# Altium project PrintNC_GRBLHAL_Breakout.PrjPCB (part 2 of 2)

## Sheet 5V_Power_Supply.SchDoc: GRBLHAL_2000_EST
size B; Author: AM; CompanyName: Expatria Technologies; DrawnBy: A.Marles; Engineer: AM; Organization: Expatria Technologies; DocumentNumber: 4; Revision: A1; SheetNumber: 4; SheetTotal: 14; PCB_Rev: A1
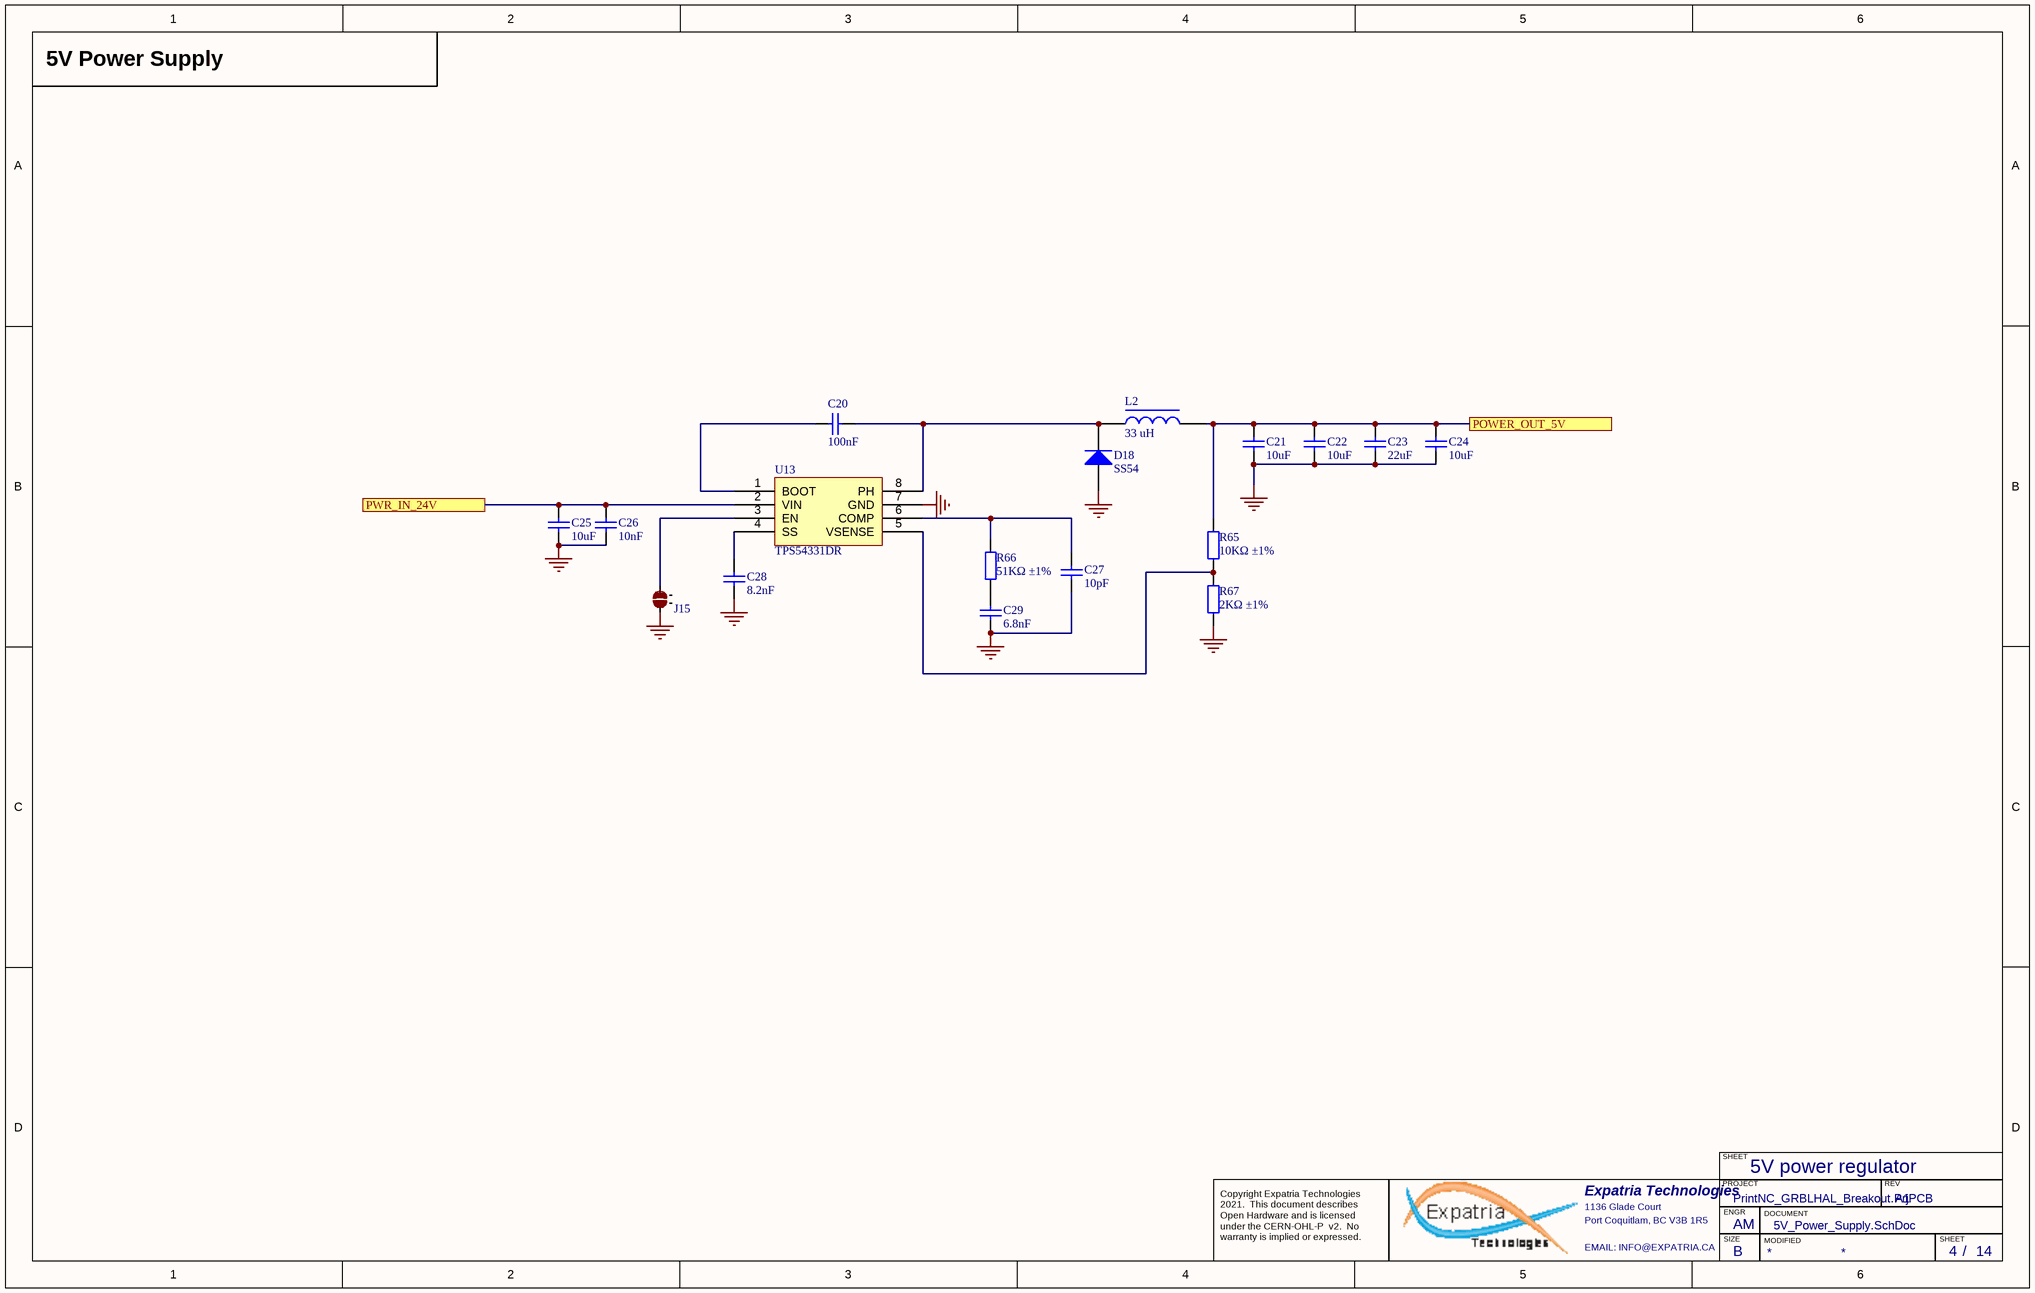
[diagram p12: 5V_Power_Supply.SchDoc]

### Parts
C20  100nF  [0603_C]
C21  10uF  [0603_C]
C22  10uF  [0603_C]
C23  22uF  [0805_C]
C24  10uF  [0603_C]
C25  10uF  [1206_C]
C26  10nF  [0402_C]
C27  10pF  [0402_C]
C28  8.2nF  [0603_C]
C29  6.8nF  [0402_C]
D18  SS54  [SMA(DO-214AC)_S1]
J15  2 way net solder junction - Normally Open  [2waySolder_NO]  (value not drawn)  (no BOM)
L2  33 uH  [INDPM7366X300N]
R65  10KΩ ±1%  [0402_R]
R66  51KΩ ±1%  [0402_R]
R67  2KΩ ±1%  [0402_R]
U13  TPS54331DR  [SOIC-8_150mil]

### Ports
POWER_OUT_5V, PWR_IN_24V

### Nets
+5V: C21.2 C22.2 C23.2 C24.2 L2.2 R65.2 ; port POWER_OUT_5V
+24V: C25.2 C26.2 U13.2(VIN) ; port PWR_IN_24V
GND: C21.1 C22.1 C23.1 C24.1 C25.1 C26.1 C27.1 C28.1 C29.1 D18.1(A) J15.1 R67.1 U13.7(GND)
NetC20_1: C20.1 U13.1(BOOT)
NetC20_2: C20.2 D18.2(K) L2.1 U13.8(PH)
NetC27_2: C27.2 R66.2 U13.6(COMP)
NetC28_2: C28.2 U13.4(SS)
NetC29_2: C29.2 R66.1
NetJ15_2: J15.2 U13.3(EN)
NetR65_1: R65.1 R67.2 U13.5(VSENSE)

### Notes on the sheet
- 5V Power Supply
- 5V power regulator
- SHEET
- Expatria Technologies
- 1136 Glade Court
- Port Coquitlam, BC V3B 1R5
- PROJECT
- SIZE
- ENGR
- MODIFIED
- DOCUMENT
- REV
- Copyright Expatria Technologies 2021.  This document describes Open Hardware and is licensed under the CERN-OHL-P  v2.  No warranty is implied or expressed.
- EMAIL: INFO@EXPATRIA.CA
- B
- /

### Library data of the parts
C20 = 0603 100nF (104) 10% 50V: Chip capacitors; Manufacturer: YAGEO; PartNumber: CC0603KRX7R9BB104; Tolerance: 10%; Voltage: 50V; Package: 0603; Supplier: LC; SuppliersPartNumber: C14663; Capacitance: 100nF
C21 C22 C24 = 0603 10uF (106) 10% 10V: Chip capacitors; Manufacturer: Samsung Electro-Mechanics; PartNumber: CL10A106KP8NNNC; Tolerance: 10%; Voltage: 10V; Package: 0603; Supplier: LC; SuppliersPartNumber: C19702; Capacitance: 10uF
C23 = 0805 22uF (226) 20% 25V: Chip capacitors; Manufacturer: Samsung Electro-Mechanics; PartNumber: CL21A226MAQNNNE; Tolerance: 20%; Voltage: 25V; Package: 0805; Supplier: LC; SuppliersPartNumber: C45783; Capacitance: 22uF
C25 = 1206 10uF (106) 10% 50V: Chip capacitors; Manufacturer: Samsung Electro-Mechanics; PartNumber: CL31A106KBHNNNE; Tolerance: 10%; Voltage: 50V; Package: 1206; Supplier: LC; SuppliersPartNumber: C13585; Capacitance: 10uF
C26 = 0402 10nF (103) 10% 50V: Chip capacitors; Manufacturer: Samsung Electro-Mechanics; PartNumber: CL05B103KB5NNNC; Tolerance: 10%; Voltage: 50V; Package: 0402; Supplier: LC; SuppliersPartNumber: C15195; Capacitance: 10nF
C27 = 0402 10pF (100) 5% 50V: Chip capacitors; Manufacturer: Samsung Electro-Mechanics; PartNumber: CL05C100JB5NNNC; Tolerance: 5%; Voltage: 50V; Package: 0402; Supplier: LC; SuppliersPartNumber: C32949; Capacitance: 10pF
C28 = 0603 8.2nF (822) 10% 50V: Chip capacitors; Manufacturer: Samsung Electro-Mechanics; PartNumber: CL10B822KB8NNNC; Tolerance: 10%; Voltage: 50V; Package: 0603; Supplier: LC; SuppliersPartNumber: C27920; Capacitance: 8.2nF
C29 = 0402 6.8nF (682) 10% 50V: Chip capacitors; Manufacturer: Guangdong Fenghua Advanced Tech; PartNumber: 0402B682K500NT; Tolerance: 10%; Voltage: 50V; Package: 0402; Supplier: LC; SuppliersPartNumber: C1542; Capacitance: 6.8nF
D18 = SMA(DO-214AC) SS54: 二极管; Package: SMA(DO-214AC); Supplier: LC; SuppliersPartNumber: C22452
J15 = 2waySolderNO
L2 = 1206 10uH 10%: 33uH ±20% 2A 270mΩ SMD,6.6x7.3x3.0mm Power Inductors RoHS; Package: SMD_6.6x7.3x3.0mm; Supplier: JLCPCB; SuppliersPartNumber: C329385
R65 = 0402 10K (1002) 1%: Chip resistor; Manufacturer: Uniroyal Elec; PartNumber: 0402WGF1002TCE; Power: 1/16W; Package: 0402; Supplier: LC; SuppliersPartNumber: C25744; Resistance: 10KΩ; Tolerance: 1%
R66 = 0402 51K (5102) 1%: Chip resistor; Manufacturer: Uniroyal Elec; PartNumber: 0402WGF5102TCE; Power: 1/16W; Package: 0402; Supplier: LC; SuppliersPartNumber: C25794; Resistance: 51KΩ; Tolerance: 1%
R67 = 0402 2K (2001) 1%: Chip resistor; Manufacturer: Uniroyal Elec; PartNumber: 0402WGF2001TCE; Power: 1/16W; Package: 0402; Supplier: LC; SuppliersPartNumber: C4109; Resistance: 2KΩ; Tolerance: 1%
U13 = TPS54331DR_[C9865]: DC-DC芯片; Package: SOIC-8_150mil; Supplier: LC; SuppliersPartNumber: C9865

## Sheet I2C_Keypad.SchDoc: GRBLHAL_2000_EST
size B; Author: AM; CompanyName: Expatria Technologies; DrawnBy: A.Marles; Engineer: AM; Organization: Expatria Technologies; DocumentNumber: 13; Revision: A1; SheetNumber: 13; SheetTotal: 14; PCB_Rev: A1
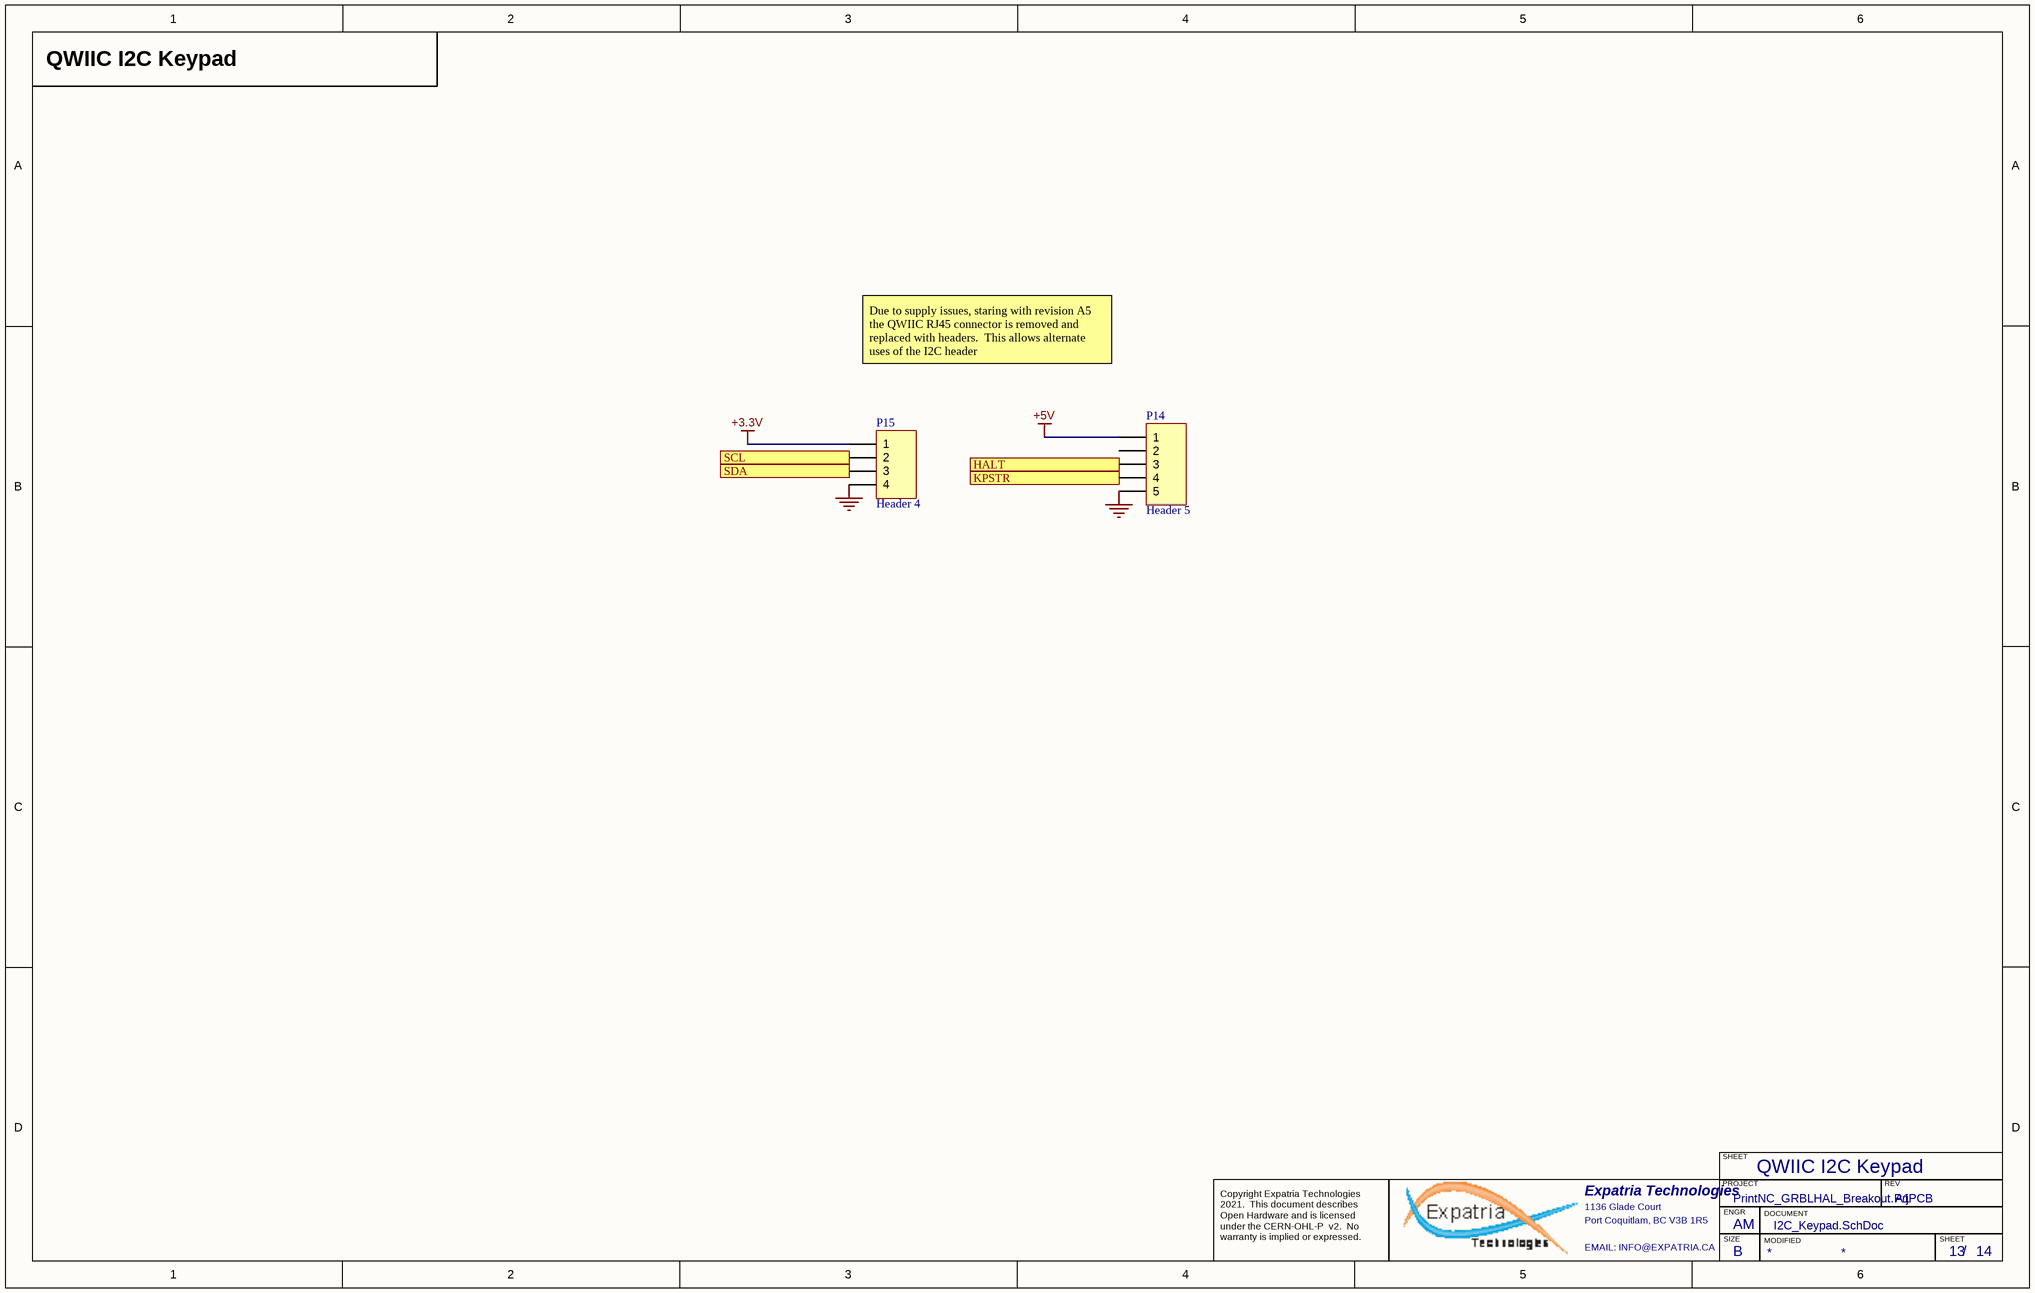
[diagram p13: I2C_Keypad.SchDoc]

### Parts
P14  Header 5  [HDR1X5]
P15  Header 4  [HDR1X4]

### Ports
HALT (out), KPSTR (out), SCL (in), SDA (in)

### Nets
+3.3V: P15.1
+5V: P14.1
GND: P14.5 P15.4
HALT: P14.3 ; port HALT
KPSTR: P14.4 ; port KPSTR
SCL: P15.2 ; port SCL
SDA: P15.3 ; port SDA

Not connected (* = marked no-connect by the designer): P14 2

### Notes on the sheet
- QWIIC I2C Keypad
- Due to supply issues, staring with revision A5 the QWIIC RJ45 connector is removed and replaced with headers.  This allows alternate uses of the I2C header
- SHEET
- Expatria Technologies
- 1136 Glade Court
- Port Coquitlam, BC V3B 1R5
- PROJECT
- SIZE
- ENGR
- MODIFIED
- DOCUMENT
- REV
- Copyright Expatria Technologies 2021.  This document describes Open Hardware and is licensed under the CERN-OHL-P  v2.  No warranty is implied or expressed.
- EMAIL: INFO@EXPATRIA.CA
- B
- /

### Library data of the parts
P14 = Header 5: Header, 5-Pin; LatestRevisionDate: 17-Jul-2002; LatestRevisionNote: Re-released for DXP Platform.; Publisher: Altium Limited; SuppliersPartNumber: C124379
P15 = Header 4: Header, 4-Pin; Publisher: Altium Limited; SuppliersPartNumber: C124378

## Sheet Spindle_Sync.SchDoc: GRBLHAL_2000_EST
size B; Author: AM; CompanyName: Expatria Technologies; DrawnBy: A.Marles; Engineer: AM; Organization: Expatria Technologies; DocumentNumber: 12; Revision: A1; SheetNumber: 12; SheetTotal: 14; PCB_Rev: A1
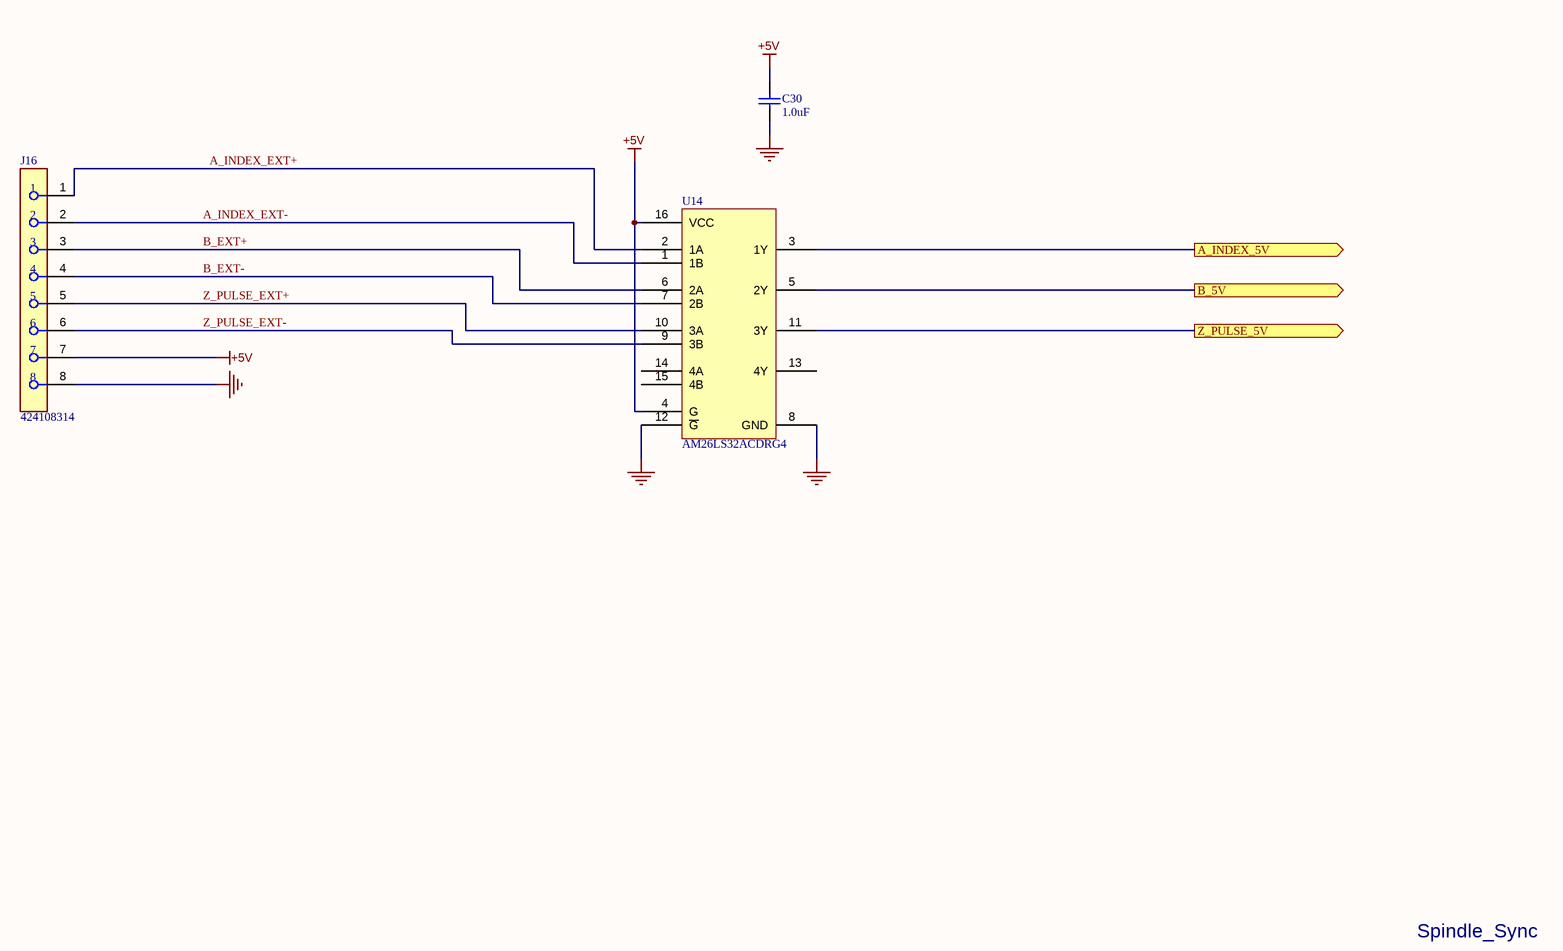
[diagram p14: Spindle_Sync.SchDoc]

### Parts
C30  1.0uF  [0402_C]
J16  424108314  [FP-5555799-1-MFG]
U14  AM26LS32ACDRG4  [SOIC-16_150mil]

### Ports
A_INDEX_5V (out), B_5V (out), Z_PULSE_5V (out)

### Nets
+5V: C30.2 J16.7 U14.4(G) U14.16(VCC)
GND: C30.1 J16.8 U14.8(GND) U14.12(~{G})
A_INDEX_EXT+: J16.1 U14.2(1A)
A_INDEX_EXT-: J16.2 U14.1(1B)
B_EXT+: J16.3 U14.6(2A)
B_EXT-: J16.4 U14.7(2B)
EXT_IN1: U14.5(2Y) ; port B_5V
EXT_IN2: U14.3(1Y) ; port A_INDEX_5V
EXT_IN3: U14.11(3Y) ; port Z_PULSE_5V
Z_PULSE_EXT+: J16.5 U14.10(3A)
Z_PULSE_EXT-: J16.6 U14.9(3B)

Not connected (* = marked no-connect by the designer): U14 13(4Y) 14(4A) 15(4B)

### Notes on the sheet
- Spindle_Sync
- SHEET
- Expatria Technologies
- 1136 Glade Court
- Port Coquitlam, BC V3B 1R5
- PROJECT
- SIZE
- ENGR
- MODIFIED
- DOCUMENT
- REV
- Copyright Expatria Technologies 2021.  This document describes Open Hardware and is licensed under the CERN-OHL-P  v2.  No warranty is implied or expressed.
- EMAIL: INFO@EXPATRIA.CA
- B
- /

### Library data of the parts
C30 = 0402 1.0uF (105) 10% 25V: Chip capacitor; Manufacturer: Samsung Electro-Mechanics; PartNumber: CL05A105KA5NQNC; Capacitance: 1uF; Tolerance: 10%; Voltage: 25V; Package: 0402; Supplier: LC; SuppliersPartNumber: C52923
J16 = CMP-03371-000003-1: CONN MOD JACK 8P8C VERT UNSHLD; SuppliersPartNumber: C563815; Supplier: LCSC
U14 = AM26LS32ACDRG4_[C6180]: 接口芯片; Package: SOIC-16_150mil; Supplier: LC; SuppliersPartNumber: C6180

## Sheet RS485.SchDoc: GRBLHAL_2000_EST
size B; Author: AM; CompanyName: Expatria Technologies; DrawnBy: A.Marles; Engineer: AM; Organization: Expatria Technologies; DocumentNumber: 11; Revision: A1; SheetNumber: 11; SheetTotal: 14; PCB_Rev: A1
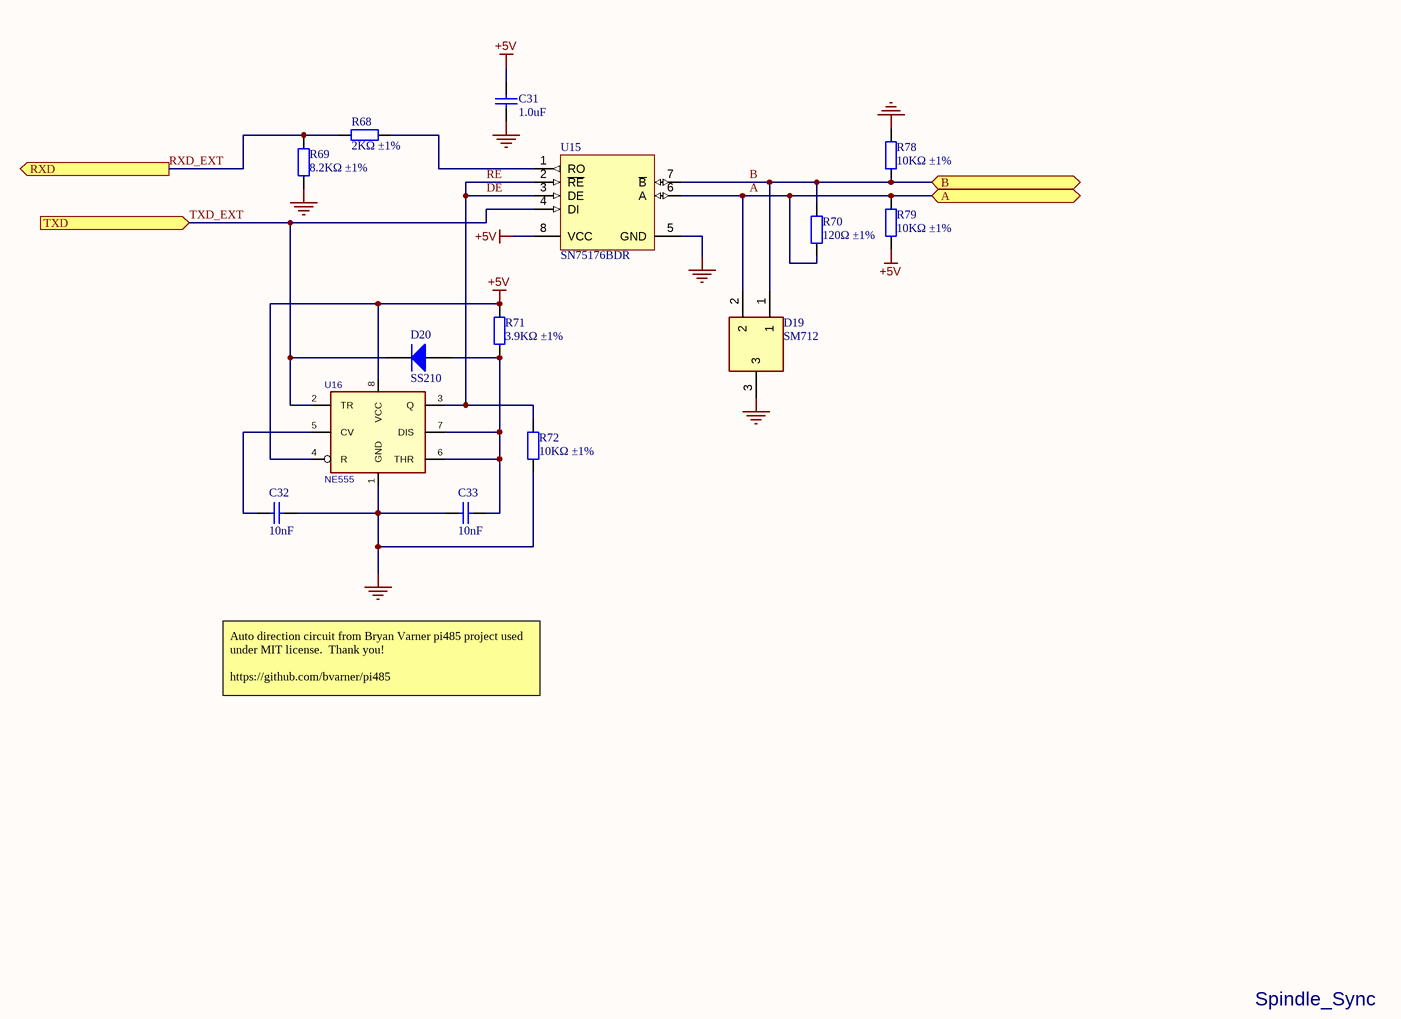
[diagram p15: RS485.SchDoc]

### Parts
C31  1.0uF  [0402_C]
C32  10nF  [0402_C]
C33  10nF  [0402_C]
D19  SM712  [SOT95P230X117-3N]
D20  SS210  [SMA(DO-214AC)_S1]
R68  2KΩ ±1%  [0402_R]
R69  8.2KΩ ±1%  [0402_R]
R70  120Ω ±1%  [0805_R]
R71  3.9KΩ ±1%  [0402_R]
R72  10KΩ ±1%  [0402_R]
R78  10KΩ ±1%  [0402_R]
R79  10KΩ ±1%  [0402_R]
U15  SN75176BDR  [SOIC-8_150mil]
U16  value NE555  [SOIC-8_150mil]  (hidden comment: NE555DR)

### Ports
A (bidir), B (bidir), RXD (out), TXD (in)

### Nets
+5V: C31.2 R71.2 R79.1 U15.8(VCC) U16.4(R) U16.8(VCC)
GND: C31.1 C32.2 C33.1 D19.3 R69.2 R72.1 R78.2 U15.5(GND) U16.1(GND)
A: D19.2 R70.1 R79.2 U15.6(A) ; port A
B: D19.1 R70.2 R78.1 U15.7(~{B}) ; port B
DE: R72.2 U15.2(~{RE}) U15.3(DE) U16.3(Q)  [also labelled RE]
RXD_EXT: R68.2 R69.1 ; port RXD
TXD_EXT: D20.2(K) U15.4(DI) U16.2(TR) ; port TXD
NetC32_1: C32.1 U16.5(CV)
NetC33_2: C33.2 D20.1(A) R71.1 U16.6(THR) U16.7(DIS)
NetR68_1: R68.1 U15.1(RO)

### Notes on the sheet
- Auto direction circuit from Bryan Varner pi485 project used under MIT license.  Thank you!
  https://github.com/bvarner/pi485
- Spindle_Sync
- SHEET
- Expatria Technologies
- 1136 Glade Court
- Port Coquitlam, BC V3B 1R5
- PROJECT
- SIZE
- ENGR
- MODIFIED
- DOCUMENT
- REV
- Copyright Expatria Technologies 2021.  This document describes Open Hardware and is licensed under the CERN-OHL-P  v2.  No warranty is implied or expressed.
- EMAIL: INFO@EXPATRIA.CA
- B
- /

### Library data of the parts
C31 = 0402 1.0uF (105) 10% 25V: as C30 on sheet Spindle_Sync; Package: 0402; Supplier: LC; SuppliersPartNumber: C52923
C32 C33 = 0402 10nF (103) 10% 50V: as C26 on sheet 5V_Power_Supply; Package: 0402; Supplier: LC; SuppliersPartNumber: C15195; Capacitance: 10nF
D19 = CDSOT23-SM712: Bidirectional 12V (Max), 7V (Max) 7.5V / 13.3V 10V / 20V 12A(8/20us) SOT-23-3 TVS RoHS; Manufacturer_Name: DOWO; Height: 1.17mm; Manufacturer_Part_Number: SM712; SuppliersPartNumber: C293966
D20 = SMA(DO-214AC) SS210: 二极管; Package: SMA(DO-214AC); Supplier: LC; SuppliersPartNumber: C14996
R68 = 0402 2K (2001) 1%: as R67 on sheet 5V_Power_Supply; Package: 0402; Supplier: LC; SuppliersPartNumber: C4109; Resistance: 2KΩ; Tolerance: 1%
R69 = 0402 8.2K (8201) 1%: Chip resistor; Manufacturer: Uniroyal Elec; PartNumber: 0402WGF8201TCE; Power: 1/16W; Package: 0402; Supplier: LC; SuppliersPartNumber: C25924; Resistance: 8.2KΩ; Tolerance: 1%
R70 = 0805 120R (1200) 1%: Chip resistor; Manufacturer: Uniroyal Elec; Power: 1/8W; Package: 0805; Supplier: LC; SuppliersPartNumber: C17437; Tolerance: 1%
R71 = 0402 3.9K (3901) 1%: Chip resistor; Manufacturer: Uniroyal Elec; PartNumber: 0402WGF3901TCE; Power: 1/16W; Package: 0402; Supplier: LC; SuppliersPartNumber: C51721; Resistance: 3.9KΩ; Tolerance: 1%
R72 R78 R79 = 0402 10K (1002) 1%: as R65 on sheet 5V_Power_Supply; Package: 0402; Supplier: LC; SuppliersPartNumber: C25744; Resistance: 10KΩ; Tolerance: 1%
U15 = SN75176BDR_[C7063]: RS-485/RS-422; Package: SOIC-8_150mil; Supplier: LC; SuppliersPartNumber: C7063
U16 = NE555: SuppliersPartNumber: C7593; Supplier: LC

## Nets that join several sheets
+3.3V: PrintNC_CNC_Breakout (10 pins), Limit_Switches (D23.A), U_PrintNC_BREAKOUT/LIM_SW/LS_X (R1_LS_X.2), U_PrintNC_BREAKOUT/LIM_SW/LS_Y (R1_LS_Y.2), U_PrintNC_BREAKOUT/LIM_SW/LS_Z (R1_LS_Z.2), U_PrintNC_BREAKOUT/LIM_SW/LS_A (R1_LS_A.2), U_PrintNC_BREAKOUT/LIM_SW/LS_B (R73_LS_B.2), Misc_switches (5 pins), U_PrintNC_BREAKOUT/USR_SW/PH_DR (R14_PH_DR.2), U_PrintNC_BREAKOUT/USR_SW/PH_CY (R14_PH_CY.2), U_PrintNC_BREAKOUT/USR_SW/PH_FD (R14_PH_FD.2), U_PrintNC_BREAKOUT/USR_SW/PH_HLT (R14_PH_HLT.2), U_PrintNC_BREAKOUT/USR_SW/PH_PR (R73_PH_PR.2), I2C_Keypad (P15.1)
+5V: PrintNC_CNC_Breakout (17 pins), Spindle_Control (P2.1), 5V_Power_Supply (6 pins), I2C_Keypad (P14.1), Spindle_Sync (C30.2 J16.7 U14.4 U14.16), RS485 (6 pins)
+12V: PrintNC_CNC_Breakout (5 pins), Limit_Switches (J1.1 J2.A1 J3.A1), U_PrintNC_BREAKOUT/LIM_SW/LS_X (D1_LS_X.A R2_LS_X.2), U_PrintNC_BREAKOUT/LIM_SW/LS_Y (D1_LS_Y.A R2_LS_Y.2), U_PrintNC_BREAKOUT/LIM_SW/LS_Z (D1_LS_Z.A R2_LS_Z.2), U_PrintNC_BREAKOUT/LIM_SW/LS_A (D1_LS_A.A R2_LS_A.2), U_PrintNC_BREAKOUT/LIM_SW/LS_B (R74_LS_B.2 R75_LS_B.2 R76_LS_B.2), Misc_switches (J4.A1 J5.1 J6.A1), U_PrintNC_BREAKOUT/USR_SW/PH_DR (U2_PH_DR.1), U_PrintNC_BREAKOUT/USR_SW/PH_CY (U2_PH_CY.1), U_PrintNC_BREAKOUT/USR_SW/PH_FD (U2_PH_FD.1), U_PrintNC_BREAKOUT/USR_SW/PH_HLT (U2_PH_HLT.1), U_PrintNC_BREAKOUT/USR_SW/PH_PR (R74_PH_PR.2 R75_PH_PR.2 R76_PH_PR.2), Spindle_Control (P2.3)
+24V: PrintNC_CNC_Breakout (5 pins), 5V_Power_Supply (C25.2 C26.2 U13.2)
GND: PrintNC_CNC_Breakout (57 pins), Limit_Switches (J1.2 J2.A3 J3.A3), U_PrintNC_BREAKOUT/LIM_SW/LS_X (C1_LS_X.1 U1_LS_X.3), U_PrintNC_BREAKOUT/LIM_SW/LS_Y (C1_LS_Y.1 U1_LS_Y.3), U_PrintNC_BREAKOUT/LIM_SW/LS_Z (C1_LS_Z.1 U1_LS_Z.3), U_PrintNC_BREAKOUT/LIM_SW/LS_A (C1_LS_A.1 U1_LS_A.3), U_PrintNC_BREAKOUT/LIM_SW/LS_B (C35_LS_B.1 U18_LS_B.3), Misc_switches (8 pins), U_PrintNC_BREAKOUT/USR_SW/PH_DR (C2_PH_DR.1 U2_PH_DR.3), U_PrintNC_BREAKOUT/USR_SW/PH_CY (C2_PH_CY.1 U2_PH_CY.3), U_PrintNC_BREAKOUT/USR_SW/PH_FD (C2_PH_FD.1 U2_PH_FD.3), U_PrintNC_BREAKOUT/USR_SW/PH_HLT (C2_PH_HLT.1 U2_PH_HLT.3), U_PrintNC_BREAKOUT/USR_SW/PH_PR (C35_PH_PR.1 U18_PH_PR.3), U_PrintNC_BREAKOUT/STP_X (5 pins), Spindle_Control (11 pins), U_PrintNC_BREAKOUT/STP_Y (5 pins), U_PrintNC_BREAKOUT/STP_Z (5 pins), U_PrintNC_BREAKOUT/STP_A (5 pins), U_PrintNC_BREAKOUT/STP_B (5 pins), 5V_Power_Supply (13 pins), I2C_Keypad (P14.5 P15.4), Spindle_Sync (C30.1 J16.8 U14.8 U14.12), RS485 (9 pins)
RELAY_VCC: PrintNC_CNC_Breakout (P9.2 R43.1), Spindle_Control (6 pins)
STEPPER_VCC: PrintNC_CNC_Breakout (L1.2), U_PrintNC_BREAKOUT/STP_X (7 pins), U_PrintNC_BREAKOUT/STP_Y (7 pins), U_PrintNC_BREAKOUT/STP_Z (7 pins), U_PrintNC_BREAKOUT/STP_A (7 pins), U_PrintNC_BREAKOUT/STP_B (7 pins)
A: PrintNC_CNC_Breakout (P11.A1), RS485 (D19.2 R70.1 R79.2 U15.6)
A_LIM: PrintNC_CNC_Breakout (P16.4 U9.23), U_PrintNC_BREAKOUT/LIM_SW/LS_A (C1_LS_A.2 R1_LS_A.1 U1_LS_A.4)
B: PrintNC_CNC_Breakout (P11.A2), RS485 (D19.1 R70.2 R78.1 U15.7)
B_LIM: PrintNC_CNC_Breakout (J12.2 P17.20 U9.28), Limit_Switches (R77.1), U_PrintNC_BREAKOUT/LIM_SW/LS_B (C35_LS_B.2 R73_LS_B.1 U18_LS_B.4)
COOLANT: PrintNC_CNC_Breakout (P16.8 U9.19), Spindle_Control (R37.1)
CYC/ST: PrintNC_CNC_Breakout (A1.7 P16.10 U9.17), Misc_switches (R9.1), U_PrintNC_BREAKOUT/USR_SW/PH_CY (C2_PH_CY.2 R14_PH_CY.1 U2_PH_CY.4)
CYC/ST_out: Misc_switches (J5.3), U_PrintNC_BREAKOUT/USR_SW/PH_CY (R15_PH_CY.1)
DIR_A: PrintNC_CNC_Breakout (P17.11 U9.9), U_PrintNC_BREAKOUT/STP_A (R20_STP_A.1)
DIR_B: PrintNC_CNC_Breakout (P17.19 U9.27), U_PrintNC_BREAKOUT/STP_B (R20_STP_B.1)
DIR_X: PrintNC_CNC_Breakout (P17.5 U9.3), U_PrintNC_BREAKOUT/STP_X (R20_STP_X.1)
DIR_Y: PrintNC_CNC_Breakout (P17.7 U9.5), U_PrintNC_BREAKOUT/STP_Y (R20_STP_Y.1)
DIR_Z: PrintNC_CNC_Breakout (P17.9 U9.7), U_PrintNC_BREAKOUT/STP_Z (R20_STP_Z.1)
DOOR: PrintNC_CNC_Breakout (A1.40 J11.2 P17.21 U9.29), Misc_switches (R7.1), U_PrintNC_BREAKOUT/USR_SW/PH_DR (C2_PH_DR.2 R14_PH_DR.1 U2_PH_DR.4)
DOOR_out: Misc_switches (J4.A2 J5.6), U_PrintNC_BREAKOUT/USR_SW/PH_DR (R15_PH_DR.1)
EXT_IN1: PrintNC_CNC_Breakout (P10.4 R59.1), Spindle_Sync (U14.5)
EXT_IN2: PrintNC_CNC_Breakout (J9.1 P10.6 R62.1), Spindle_Sync (U14.3)
EXT_IN3: PrintNC_CNC_Breakout (P10.3 R64.1), Spindle_Sync (U14.11)
FD/HLD: PrintNC_CNC_Breakout (A1.16 J14.2 P16.11 U9.16), Misc_switches (R11.1), U_PrintNC_BREAKOUT/USR_SW/PH_FD (C2_PH_FD.2 R14_PH_FD.1 U2_PH_FD.4)
HALT: PrintNC_CNC_Breakout (A1.37 J13.2 P16.17 U9.40), Misc_switches (R13.1), U_PrintNC_BREAKOUT/USR_SW/PH_HLT (C2_PH_HLT.2 R14_PH_HLT.1 U2_PH_HLT.4), I2C_Keypad (P14.3)
HALT_out: Misc_switches (J5.5 J6.A2), U_PrintNC_BREAKOUT/USR_SW/PH_HLT (R15_PH_HLT.1)
HOLD_out: Misc_switches (J5.4), U_PrintNC_BREAKOUT/USR_SW/PH_FD (R15_PH_FD.1)
KPSTR: PrintNC_CNC_Breakout (A1.13 P16.16 U9.41), I2C_Keypad (P14.4)
LIMIT_SW: Limit_Switches (J1.3), U_PrintNC_BREAKOUT/LIM_SW/LS_X (R3_LS_X.1 U1_LS_X.2)
LIMIT_SW: Limit_Switches (J1.4), U_PrintNC_BREAKOUT/LIM_SW/LS_Y (R3_LS_Y.1 U1_LS_Y.2)
LIMIT_SW: Limit_Switches (J1.5), U_PrintNC_BREAKOUT/LIM_SW/LS_Z (R3_LS_Z.1 U1_LS_Z.2)
LIMIT_SW: Limit_Switches (J1.6), U_PrintNC_BREAKOUT/LIM_SW/LS_A (R3_LS_A.1 U1_LS_A.2)
MAXLIM: Limit_Switches (J1.8), U_PrintNC_BREAKOUT/USR_SW/PH_PR (D21_PH_PR.2 D22_PH_PR.2 R76_PH_PR.1)
MAXLIM: Limit_Switches (J3.A2), U_PrintNC_BREAKOUT/LIM_SW/LS_B (D21_LS_B.2 D22_LS_B.2 R76_LS_B.1)
MINLIM: Limit_Switches (J1.7), U_PrintNC_BREAKOUT/USR_SW/PH_PR (D21_PH_PR.1 D22_PH_PR.1 R75_PH_PR.1)
MINLIM: Limit_Switches (J2.A2), U_PrintNC_BREAKOUT/LIM_SW/LS_B (D21_LS_B.1 D22_LS_B.1 R75_LS_B.1)
MIST: PrintNC_CNC_Breakout (P16.9 U9.18), Spindle_Control (R41.1)
PROBE: PrintNC_CNC_Breakout (P16.12 U9.15), Misc_switches (R5.1), U_PrintNC_BREAKOUT/USR_SW/PH_PR (C35_PH_PR.2 R73_PH_PR.1 U18_PH_PR.4)
RXD_EXT: PrintNC_CNC_Breakout (P13.3 P17.2 R60.1 U9.0), RS485 (R68.2 R69.1)
SCL: PrintNC_CNC_Breakout (5 pins), I2C_Keypad (P15.2)
SDA: PrintNC_CNC_Breakout (5 pins), I2C_Keypad (P15.3)
SPINDLE_DIR: PrintNC_CNC_Breakout (P17.13 U9.11), Spindle_Control (R30.1)
SPINDLE_EN: PrintNC_CNC_Breakout (A1.11 P17.14 U9.12), Spindle_Control (R34.1)
SPINDLE_PWM: PrintNC_CNC_Breakout (P16.14 U9.13), Spindle_Control (R23.1)
STEP_A: PrintNC_CNC_Breakout (P17.10 U9.8), U_PrintNC_BREAKOUT/STP_A (R19_STP_A.1)
STEP_B: PrintNC_CNC_Breakout (P17.18 U9.26), U_PrintNC_BREAKOUT/STP_B (R19_STP_B.1)
STEP_X: PrintNC_CNC_Breakout (P17.4 U9.2), U_PrintNC_BREAKOUT/STP_X (R19_STP_X.1)
STEP_Y: PrintNC_CNC_Breakout (P17.6 U9.4), U_PrintNC_BREAKOUT/STP_Y (R19_STP_Y.1)
STEP_Z: PrintNC_CNC_Breakout (P17.8 U9.6), U_PrintNC_BREAKOUT/STP_Z (R19_STP_Z.1)
STP_ALARM_5V_n: PrintNC_CNC_Breakout (C13.2 R49.1 U11.13), U_PrintNC_BREAKOUT/STP_X (P1_STP_X.8), U_PrintNC_BREAKOUT/STP_Y (P1_STP_Y.8), U_PrintNC_BREAKOUT/STP_Z (P1_STP_Z.8), U_PrintNC_BREAKOUT/STP_A (P1_STP_A.8), U_PrintNC_BREAKOUT/STP_B (P1_STP_B.8)
STP_EN: PrintNC_CNC_Breakout (P17.12 U9.10), U_PrintNC_BREAKOUT/STP_X (R21_STP_X.1), U_PrintNC_BREAKOUT/STP_Y (R21_STP_Y.1), U_PrintNC_BREAKOUT/STP_A (R21_STP_A.1), U_PrintNC_BREAKOUT/STP_B (R21_STP_B.1)
STP_EN_Z: PrintNC_CNC_Breakout (P16.18 U9.39), U_PrintNC_BREAKOUT/STP_Z (R21_STP_Z.1)
TXD_EXT: PrintNC_CNC_Breakout (P13.2 P17.3 R58.2 U9.1), RS485 (D20.2 U15.4 U16.2)
X_LIM: PrintNC_CNC_Breakout (P16.7 U9.20), U_PrintNC_BREAKOUT/LIM_SW/LS_X (C1_LS_X.2 R1_LS_X.1 U1_LS_X.4)
Y_LIM: PrintNC_CNC_Breakout (P16.6 U9.21), U_PrintNC_BREAKOUT/LIM_SW/LS_Y (C1_LS_Y.2 R1_LS_Y.1 U1_LS_Y.4)
Z_LIM: PrintNC_CNC_Breakout (P16.5 U9.22), U_PrintNC_BREAKOUT/LIM_SW/LS_Z (C1_LS_Z.2 R1_LS_Z.1 U1_LS_Z.4)

## Assembly variants
SMT_ONLY: not fitted A1 J1 J2 J3 J4 J5 J6 J7 J8 J9 J10 J11 J12 J13 J14 J15 J16 J17 J18 J19 J20 J21 J22 J22 J23 J23 J24 J25 J26 J27 J28 L3 P1 P2 P3 P4 P5 P6 P7 P8 P9 P10 P11 P12 P12 P13 P13 P14 P14 P15 P15 P16 P16 P16 P17 P17 P18 P18 P19 P19 R76 U15 VR2
FULL_ASSEMBLY: not fitted J? J? J? J? R76 U15